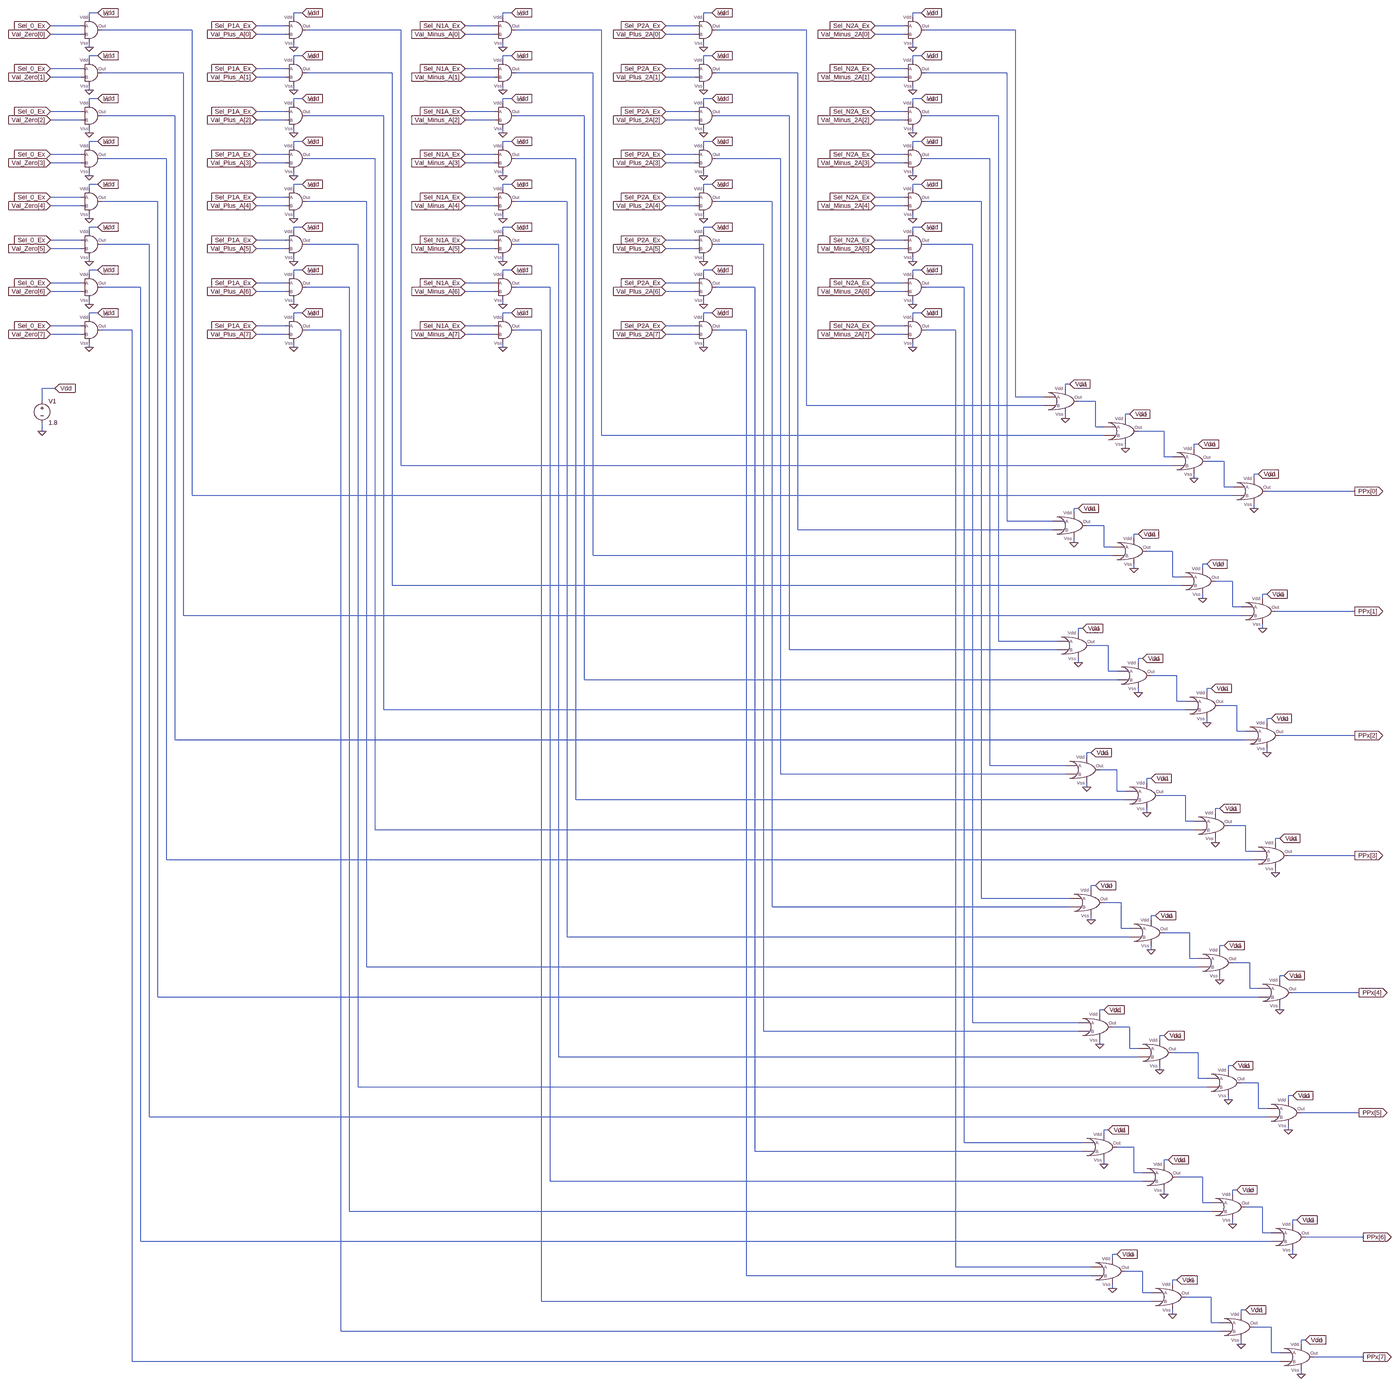
[diagram p0: schematic MUX.asc, whole sheet]
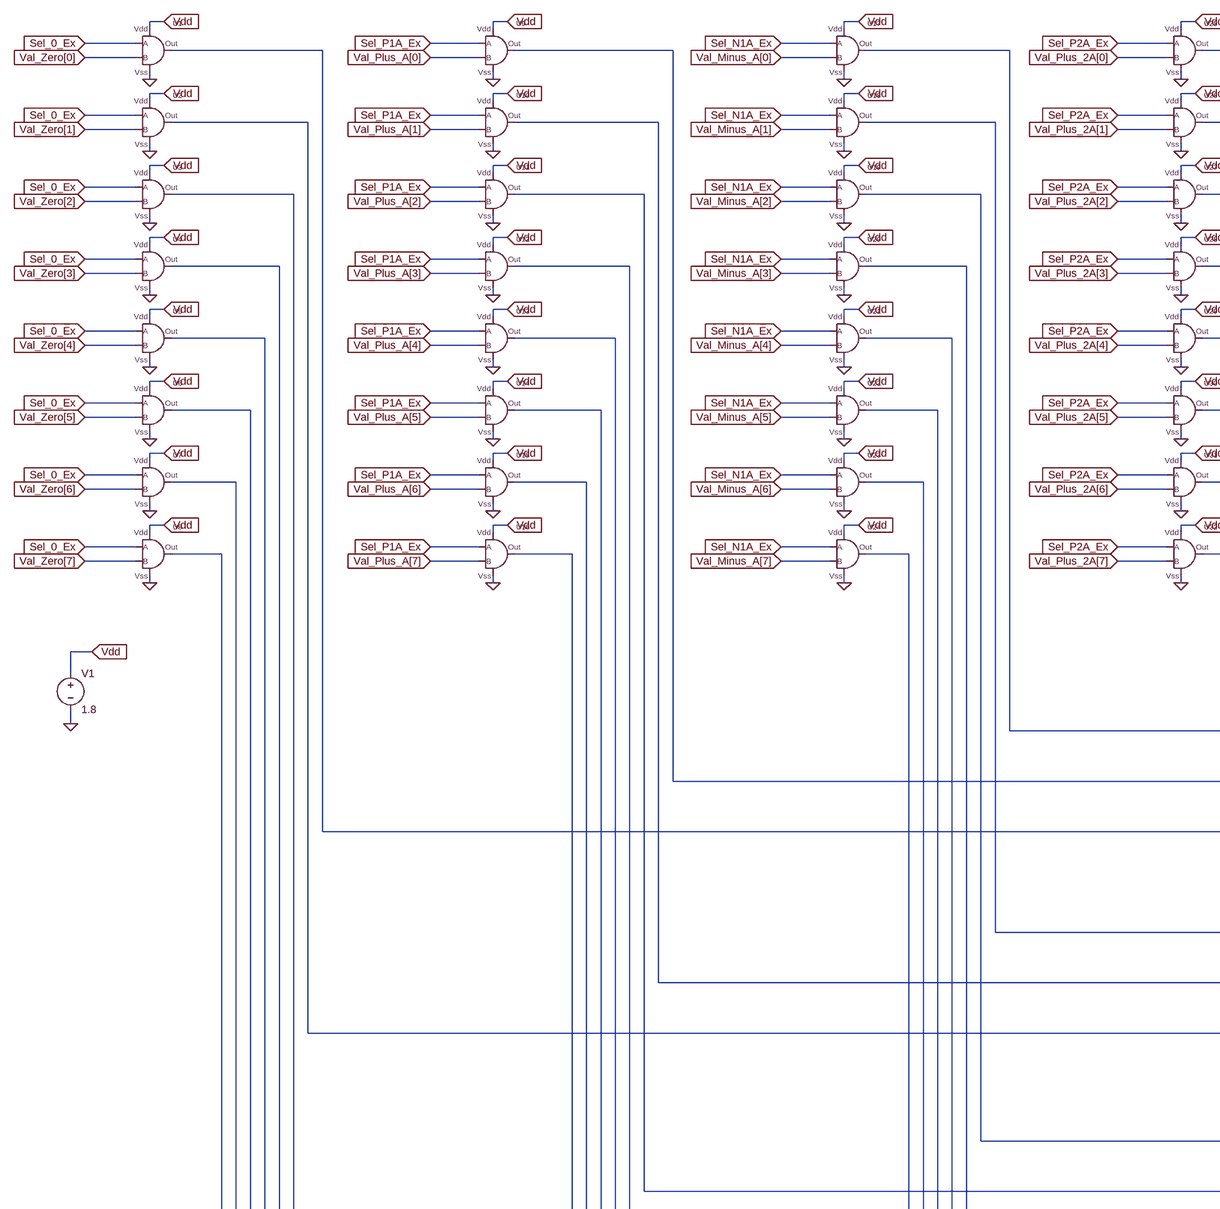
[diagram p1: schematic MUX.asc, part, row 1 of 2, column 1 of 2]
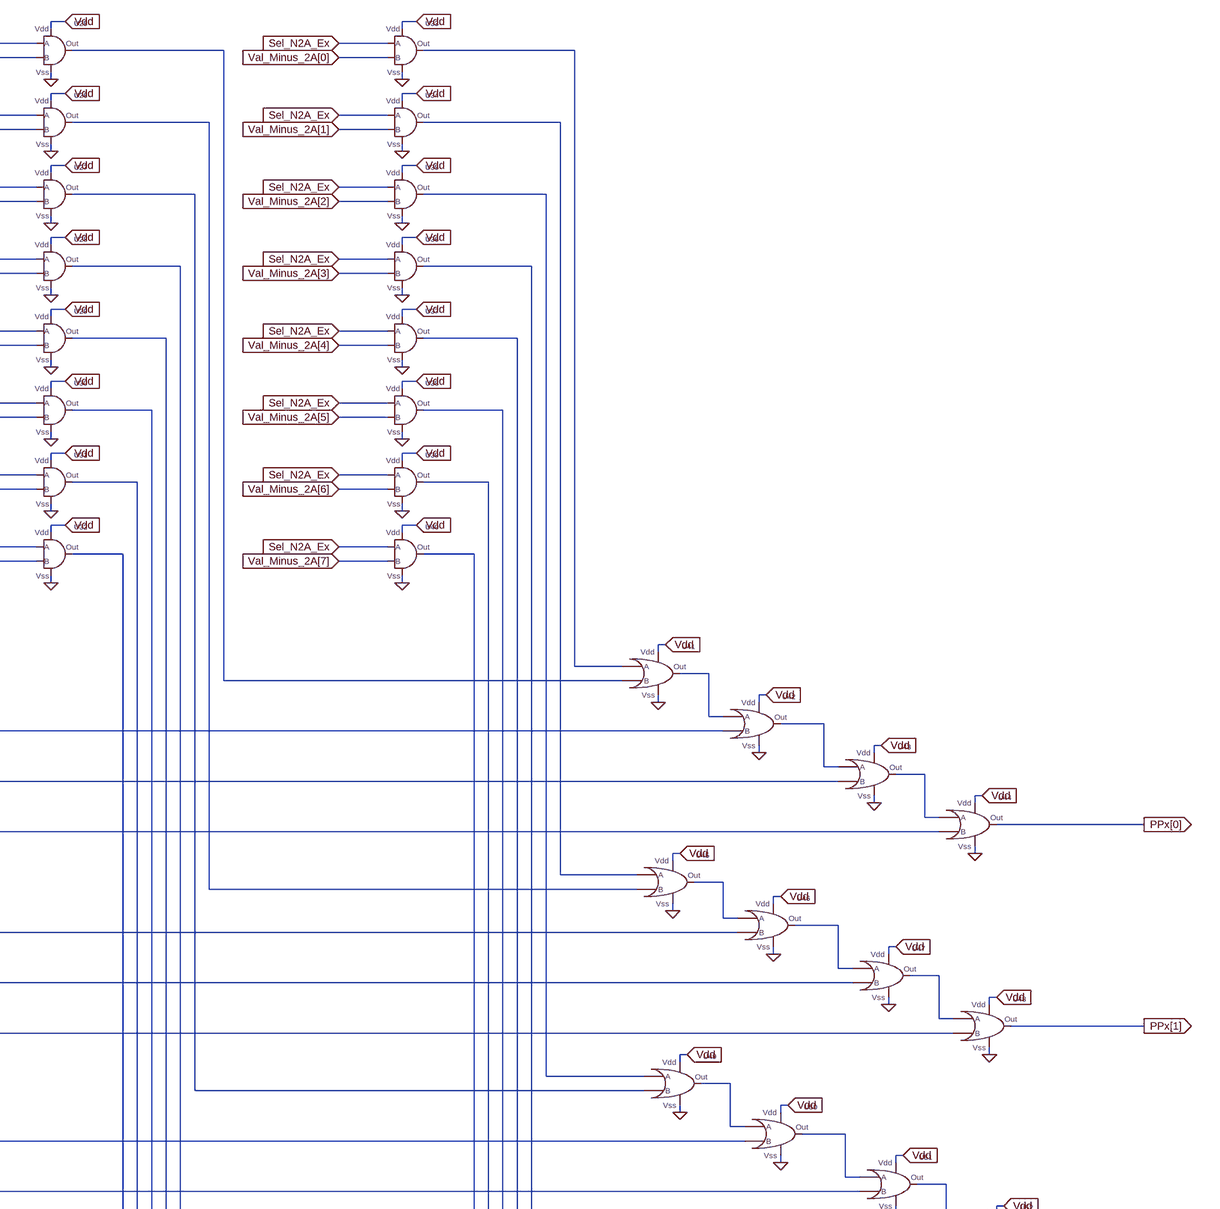
[diagram p2: schematic MUX.asc, part, row 1 of 2, column 2 of 2]
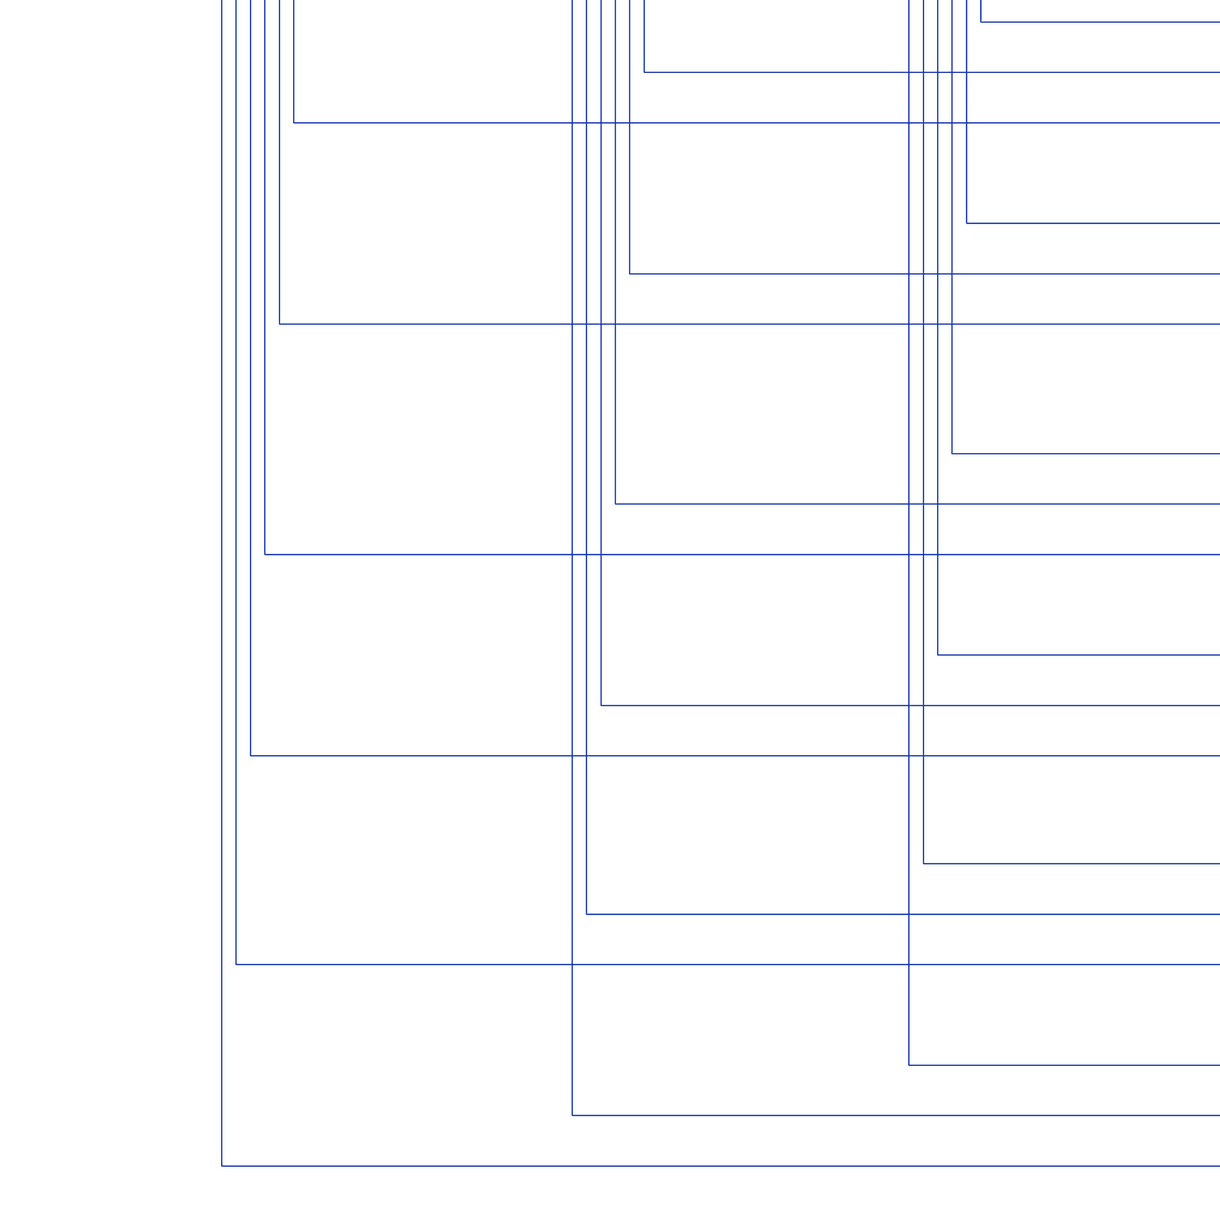
[diagram p3: schematic MUX.asc, part, row 2 of 2, column 1 of 2]
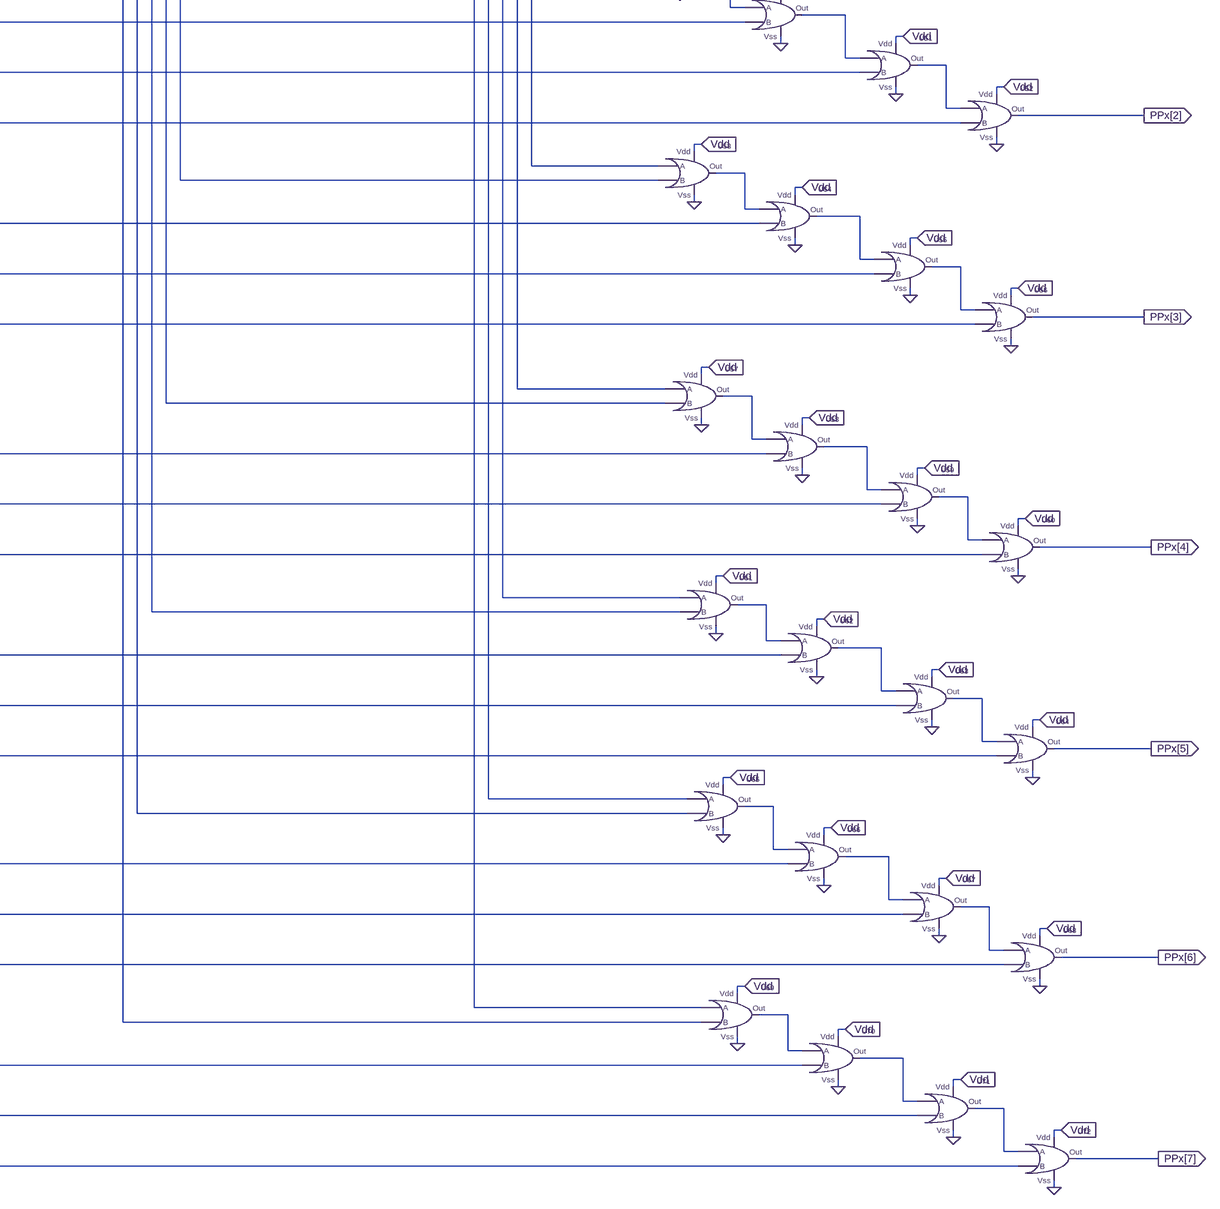
[diagram p4: schematic MUX.asc, part, row 2 of 2, column 2 of 2]
MUX.asc, the LTspice schematic file:
Version 4
SHEET 1 5656 4884
WIRE 176 -256 144 -256
WIRE 944 -256 912 -256
WIRE 1728 -256 1696 -256
WIRE 2480 -256 2448 -256
WIRE 3264 -256 3232 -256
WIRE 144 -240 144 -256
WIRE 912 -240 912 -256
WIRE 1696 -240 1696 -256
WIRE 2448 -240 2448 -256
WIRE 3232 -240 3232 -256
WIRE 112 -208 0 -208
WIRE 880 -208 768 -208
WIRE 1664 -208 1552 -208
WIRE 2416 -208 2304 -208
WIRE 3200 -208 3088 -208
WIRE 528 -192 192 -192
WIRE 1312 -192 960 -192
WIRE 2064 -192 1744 -192
WIRE 2832 -192 2496 -192
WIRE 3616 -192 3280 -192
WIRE 112 -176 0 -176
WIRE 880 -176 768 -176
WIRE 1664 -176 1552 -176
WIRE 2416 -176 2304 -176
WIRE 3200 -176 3088 -176
WIRE 144 -128 144 -144
WIRE 912 -128 912 -144
WIRE 1696 -128 1696 -144
WIRE 2448 -128 2448 -144
WIRE 3232 -128 3232 -144
WIRE 176 -96 144 -96
WIRE 944 -96 912 -96
WIRE 1728 -96 1696 -96
WIRE 2480 -96 2448 -96
WIRE 3264 -96 3232 -96
WIRE 144 -80 144 -96
WIRE 912 -80 912 -96
WIRE 1696 -80 1696 -96
WIRE 2448 -80 2448 -96
WIRE 3232 -80 3232 -96
WIRE 112 -48 0 -48
WIRE 880 -48 768 -48
WIRE 1664 -48 1552 -48
WIRE 2416 -48 2304 -48
WIRE 3200 -48 3088 -48
WIRE 496 -32 192 -32
WIRE 1280 -32 960 -32
WIRE 2032 -32 1744 -32
WIRE 2800 -32 2496 -32
WIRE 3584 -32 3280 -32
WIRE 112 -16 0 -16
WIRE 880 -16 768 -16
WIRE 1664 -16 1552 -16
WIRE 2416 -16 2304 -16
WIRE 3200 -16 3088 -16
WIRE 144 32 144 16
WIRE 912 32 912 16
WIRE 1696 32 1696 16
WIRE 2448 32 2448 16
WIRE 3232 32 3232 16
WIRE 176 64 144 64
WIRE 944 64 912 64
WIRE 1728 64 1696 64
WIRE 2480 64 2448 64
WIRE 3264 64 3232 64
WIRE 144 80 144 64
WIRE 912 80 912 64
WIRE 1696 80 1696 64
WIRE 2448 80 2448 64
WIRE 3232 80 3232 64
WIRE 112 112 0 112
WIRE 880 112 768 112
WIRE 1664 112 1552 112
WIRE 2416 112 2304 112
WIRE 3200 112 3088 112
WIRE 464 128 192 128
WIRE 1248 128 960 128
WIRE 2000 128 1744 128
WIRE 2768 128 2496 128
WIRE 3552 128 3280 128
WIRE 112 144 0 144
WIRE 880 144 768 144
WIRE 1664 144 1552 144
WIRE 2416 144 2304 144
WIRE 3200 144 3088 144
WIRE 144 192 144 176
WIRE 912 192 912 176
WIRE 1696 192 1696 176
WIRE 2448 192 2448 176
WIRE 3232 192 3232 176
WIRE 176 224 144 224
WIRE 944 224 912 224
WIRE 1728 224 1696 224
WIRE 2480 224 2448 224
WIRE 3264 224 3232 224
WIRE 144 240 144 224
WIRE 912 240 912 224
WIRE 1696 240 1696 224
WIRE 2448 240 2448 224
WIRE 3232 240 3232 224
WIRE 112 272 0 272
WIRE 880 272 768 272
WIRE 1664 272 1552 272
WIRE 2416 272 2304 272
WIRE 3200 272 3088 272
WIRE 432 288 192 288
WIRE 1216 288 960 288
WIRE 1968 288 1744 288
WIRE 2736 288 2496 288
WIRE 3520 288 3280 288
WIRE 112 304 0 304
WIRE 880 304 768 304
WIRE 1664 304 1552 304
WIRE 2416 304 2304 304
WIRE 3200 304 3088 304
WIRE 144 352 144 336
WIRE 912 352 912 336
WIRE 1696 352 1696 336
WIRE 2448 352 2448 336
WIRE 3232 352 3232 336
WIRE 176 384 144 384
WIRE 944 384 912 384
WIRE 1728 384 1696 384
WIRE 2480 384 2448 384
WIRE 3264 384 3232 384
WIRE 144 400 144 384
WIRE 912 400 912 384
WIRE 1696 400 1696 384
WIRE 2448 400 2448 384
WIRE 3232 400 3232 384
WIRE 112 432 0 432
WIRE 880 432 768 432
WIRE 1664 432 1552 432
WIRE 2416 432 2304 432
WIRE 3200 432 3088 432
WIRE 400 448 192 448
WIRE 1184 448 960 448
WIRE 1936 448 1744 448
WIRE 2704 448 2496 448
WIRE 3488 448 3280 448
WIRE 112 464 0 464
WIRE 880 464 768 464
WIRE 1664 464 1552 464
WIRE 2416 464 2304 464
WIRE 3200 464 3088 464
WIRE 144 512 144 496
WIRE 912 512 912 496
WIRE 1696 512 1696 496
WIRE 2448 512 2448 496
WIRE 3232 512 3232 496
WIRE 176 544 144 544
WIRE 944 544 912 544
WIRE 1728 544 1696 544
WIRE 2480 544 2448 544
WIRE 3264 544 3232 544
WIRE 144 560 144 544
WIRE 912 560 912 544
WIRE 1696 560 1696 544
WIRE 2448 560 2448 544
WIRE 3232 560 3232 544
WIRE 112 592 0 592
WIRE 880 592 768 592
WIRE 1664 592 1552 592
WIRE 2416 592 2304 592
WIRE 3200 592 3088 592
WIRE 368 608 192 608
WIRE 1152 608 960 608
WIRE 1904 608 1744 608
WIRE 2672 608 2496 608
WIRE 3456 608 3280 608
WIRE 112 624 0 624
WIRE 880 624 768 624
WIRE 1664 624 1552 624
WIRE 2416 624 2304 624
WIRE 3200 624 3088 624
WIRE 144 672 144 656
WIRE 912 672 912 656
WIRE 1696 672 1696 656
WIRE 2448 672 2448 656
WIRE 3232 672 3232 656
WIRE 176 704 144 704
WIRE 944 704 912 704
WIRE 1728 704 1696 704
WIRE 2480 704 2448 704
WIRE 3264 704 3232 704
WIRE 144 720 144 704
WIRE 912 720 912 704
WIRE 1696 720 1696 704
WIRE 2448 720 2448 704
WIRE 3232 720 3232 704
WIRE 112 752 0 752
WIRE 880 752 768 752
WIRE 1664 752 1552 752
WIRE 2416 752 2304 752
WIRE 3200 752 3088 752
WIRE 336 768 192 768
WIRE 1120 768 960 768
WIRE 1872 768 1744 768
WIRE 2640 768 2496 768
WIRE 3424 768 3280 768
WIRE 112 784 0 784
WIRE 880 784 768 784
WIRE 1664 784 1552 784
WIRE 2416 784 2304 784
WIRE 3200 784 3088 784
WIRE 144 832 144 816
WIRE 912 832 912 816
WIRE 1696 832 1696 816
WIRE 2448 832 2448 816
WIRE 3232 832 3232 816
WIRE 176 864 144 864
WIRE 944 864 912 864
WIRE 1728 864 1696 864
WIRE 2480 864 2448 864
WIRE 3264 864 3232 864
WIRE 144 880 144 864
WIRE 912 880 912 864
WIRE 1696 880 1696 864
WIRE 2448 880 2448 864
WIRE 3232 880 3232 864
WIRE 112 912 0 912
WIRE 880 912 768 912
WIRE 1664 912 1552 912
WIRE 2416 912 2304 912
WIRE 3200 912 3088 912
WIRE 304 928 192 928
WIRE 1088 928 960 928
WIRE 1840 928 1744 928
WIRE 2608 928 2496 928
WIRE 3392 928 3280 928
WIRE 112 944 0 944
WIRE 880 944 768 944
WIRE 1664 944 1552 944
WIRE 2416 944 2304 944
WIRE 3200 944 3088 944
WIRE 144 992 144 976
WIRE 912 992 912 976
WIRE 1696 992 1696 976
WIRE 2448 992 2448 976
WIRE 3232 992 3232 976
WIRE 3856 1168 3840 1168
WIRE 16 1184 -32 1184
WIRE 3840 1184 3840 1168
WIRE 3616 1216 3616 -192
WIRE 3760 1216 3616 1216
WIRE -32 1232 -32 1184
WIRE 3952 1232 3888 1232
WIRE 2832 1248 2832 -192
WIRE 3760 1248 2832 1248
WIRE 4080 1280 4064 1280
WIRE 3840 1296 3840 1280
WIRE 4064 1296 4064 1280
WIRE 3952 1328 3952 1232
WIRE 3984 1328 3952 1328
WIRE -32 1344 -32 1312
WIRE 4208 1344 4112 1344
WIRE 2064 1360 2064 -192
WIRE 3984 1360 2064 1360
WIRE 4336 1392 4320 1392
WIRE 4064 1408 4064 1392
WIRE 4320 1408 4320 1392
WIRE 4208 1440 4208 1344
WIRE 4240 1440 4208 1440
WIRE 4432 1456 4368 1456
WIRE 1312 1472 1312 -192
WIRE 4240 1472 1312 1472
WIRE 4560 1504 4544 1504
WIRE 4320 1520 4320 1504
WIRE 4544 1520 4544 1504
WIRE 4432 1552 4432 1456
WIRE 4464 1552 4432 1552
WIRE 4928 1568 4592 1568
WIRE 528 1584 528 -192
WIRE 4464 1584 528 1584
WIRE 3888 1632 3872 1632
WIRE 4544 1632 4544 1616
WIRE 3872 1648 3872 1632
WIRE 3584 1680 3584 -32
WIRE 3792 1680 3584 1680
WIRE 3984 1696 3920 1696
WIRE 2800 1712 2800 -32
WIRE 3792 1712 2800 1712
WIRE 4112 1728 4096 1728
WIRE 4096 1744 4096 1728
WIRE 3872 1760 3872 1744
WIRE 3984 1776 3984 1696
WIRE 4016 1776 3984 1776
WIRE 4240 1792 4144 1792
WIRE 2032 1808 2032 -32
WIRE 4016 1808 2032 1808
WIRE 4368 1840 4352 1840
WIRE 4096 1856 4096 1840
WIRE 4352 1856 4352 1840
WIRE 4240 1888 4240 1792
WIRE 4272 1888 4240 1888
WIRE 4464 1904 4400 1904
WIRE 1280 1920 1280 -32
WIRE 4272 1920 1280 1920
WIRE 4592 1952 4576 1952
WIRE 4352 1968 4352 1952
WIRE 4576 1968 4576 1952
WIRE 4464 2000 4464 1904
WIRE 4496 2000 4464 2000
WIRE 4928 2016 4624 2016
WIRE 496 2032 496 -32
WIRE 4496 2032 496 2032
WIRE 3904 2080 3888 2080
WIRE 4576 2080 4576 2064
WIRE 3888 2096 3888 2080
WIRE 3552 2128 3552 128
WIRE 3808 2128 3552 2128
WIRE 4000 2144 3936 2144
WIRE 2768 2160 2768 128
WIRE 3808 2160 2768 2160
WIRE 4128 2192 4112 2192
WIRE 3888 2208 3888 2192
WIRE 4112 2208 4112 2192
WIRE 4000 2240 4000 2144
WIRE 4032 2240 4000 2240
WIRE 4256 2256 4160 2256
WIRE 2000 2272 2000 128
WIRE 4032 2272 2000 2272
WIRE 4384 2304 4368 2304
WIRE 4112 2320 4112 2304
WIRE 4368 2320 4368 2304
WIRE 4256 2352 4256 2256
WIRE 4288 2352 4256 2352
WIRE 4480 2368 4416 2368
WIRE 1248 2384 1248 128
WIRE 4288 2384 1248 2384
WIRE 4608 2416 4592 2416
WIRE 4368 2432 4368 2416
WIRE 4592 2432 4592 2416
WIRE 4480 2464 4480 2368
WIRE 4512 2464 4480 2464
WIRE 4928 2480 4640 2480
WIRE 464 2496 464 128
WIRE 4512 2496 464 2496
WIRE 3936 2544 3920 2544
WIRE 4592 2544 4592 2528
WIRE 3920 2560 3920 2544
WIRE 3520 2592 3520 288
WIRE 3840 2592 3520 2592
WIRE 4032 2608 3968 2608
WIRE 2736 2624 2736 288
WIRE 3840 2624 2736 2624
WIRE 4160 2640 4144 2640
WIRE 4144 2656 4144 2640
WIRE 3920 2672 3920 2656
WIRE 4032 2688 4032 2608
WIRE 4064 2688 4032 2688
WIRE 4288 2704 4192 2704
WIRE 1968 2720 1968 288
WIRE 4064 2720 1968 2720
WIRE 4416 2752 4400 2752
WIRE 4144 2768 4144 2752
WIRE 4400 2768 4400 2752
WIRE 4288 2800 4288 2704
WIRE 4320 2800 4288 2800
WIRE 4512 2816 4448 2816
WIRE 1216 2832 1216 288
WIRE 4320 2832 1216 2832
WIRE 4640 2864 4624 2864
WIRE 4400 2880 4400 2864
WIRE 4624 2880 4624 2864
WIRE 4512 2912 4512 2816
WIRE 4544 2912 4512 2912
WIRE 4928 2928 4672 2928
WIRE 432 2944 432 288
WIRE 4544 2944 432 2944
WIRE 4624 2992 4624 2976
WIRE 3952 3040 3936 3040
WIRE 3936 3056 3936 3040
WIRE 3488 3088 3488 448
WIRE 3856 3088 3488 3088
WIRE 4048 3104 3984 3104
WIRE 2704 3120 2704 448
WIRE 3856 3120 2704 3120
WIRE 4176 3152 4160 3152
WIRE 3936 3168 3936 3152
WIRE 4160 3168 4160 3152
WIRE 4048 3200 4048 3104
WIRE 4080 3200 4048 3200
WIRE 4304 3216 4208 3216
WIRE 1936 3232 1936 448
WIRE 4080 3232 1936 3232
WIRE 4432 3264 4416 3264
WIRE 4160 3280 4160 3264
WIRE 4416 3280 4416 3264
WIRE 4304 3312 4304 3216
WIRE 4336 3312 4304 3312
WIRE 4528 3328 4464 3328
WIRE 1184 3344 1184 448
WIRE 4336 3344 1184 3344
WIRE 4656 3376 4640 3376
WIRE 4416 3392 4416 3376
WIRE 4640 3392 4640 3376
WIRE 4528 3424 4528 3328
WIRE 4560 3424 4528 3424
WIRE 4944 3440 4688 3440
WIRE 400 3456 400 448
WIRE 4560 3456 400 3456
WIRE 3984 3504 3968 3504
WIRE 4640 3504 4640 3488
WIRE 3968 3520 3968 3504
WIRE 3456 3552 3456 608
WIRE 3888 3552 3456 3552
WIRE 4080 3568 4016 3568
WIRE 2672 3584 2672 608
WIRE 3888 3584 2672 3584
WIRE 4208 3600 4192 3600
WIRE 4192 3616 4192 3600
WIRE 3968 3632 3968 3616
WIRE 4080 3648 4080 3568
WIRE 4112 3648 4080 3648
WIRE 4336 3664 4240 3664
WIRE 1904 3680 1904 608
WIRE 4112 3680 1904 3680
WIRE 4464 3712 4448 3712
WIRE 4192 3728 4192 3712
WIRE 4448 3728 4448 3712
WIRE 4336 3760 4336 3664
WIRE 4368 3760 4336 3760
WIRE 4560 3776 4496 3776
WIRE 1152 3792 1152 608
WIRE 4368 3792 1152 3792
WIRE 4688 3824 4672 3824
WIRE 4448 3840 4448 3824
WIRE 4672 3840 4672 3824
WIRE 4560 3872 4560 3776
WIRE 4592 3872 4560 3872
WIRE 4944 3888 4720 3888
WIRE 368 3904 368 608
WIRE 4592 3904 368 3904
WIRE 4000 3952 3984 3952
WIRE 4672 3952 4672 3936
WIRE 3984 3968 3984 3952
WIRE 3424 4000 3424 768
WIRE 3904 4000 3424 4000
WIRE 4096 4016 4032 4016
WIRE 2640 4032 2640 768
WIRE 3904 4032 2640 4032
WIRE 4224 4064 4208 4064
WIRE 3984 4080 3984 4064
WIRE 4208 4080 4208 4064
WIRE 4096 4112 4096 4016
WIRE 4128 4112 4096 4112
WIRE 4352 4128 4256 4128
WIRE 1872 4144 1872 768
WIRE 4128 4144 1872 4144
WIRE 4480 4176 4464 4176
WIRE 4208 4192 4208 4176
WIRE 4464 4192 4464 4176
WIRE 4352 4224 4352 4128
WIRE 4384 4224 4352 4224
WIRE 4576 4240 4512 4240
WIRE 1120 4256 1120 768
WIRE 4384 4256 1120 4256
WIRE 4704 4288 4688 4288
WIRE 4464 4304 4464 4288
WIRE 4688 4304 4688 4288
WIRE 4576 4336 4576 4240
WIRE 4608 4336 4576 4336
WIRE 4960 4352 4736 4352
WIRE 336 4368 336 768
WIRE 4608 4368 336 4368
WIRE 4032 4416 4016 4416
WIRE 4688 4416 4688 4400
WIRE 4016 4432 4016 4416
WIRE 3392 4464 3392 928
WIRE 3936 4464 3392 4464
WIRE 4128 4480 4064 4480
WIRE 2608 4496 2608 928
WIRE 3936 4496 2608 4496
WIRE 4256 4512 4240 4512
WIRE 4240 4528 4240 4512
WIRE 4016 4544 4016 4528
WIRE 4128 4560 4128 4480
WIRE 4160 4560 4128 4560
WIRE 4384 4576 4288 4576
WIRE 1840 4592 1840 928
WIRE 4160 4592 1840 4592
WIRE 4512 4624 4496 4624
WIRE 4240 4640 4240 4624
WIRE 4496 4640 4496 4624
WIRE 4384 4672 4384 4576
WIRE 4416 4672 4384 4672
WIRE 4608 4688 4544 4688
WIRE 1088 4704 1088 928
WIRE 4416 4704 1088 4704
WIRE 4736 4736 4720 4736
WIRE 4496 4752 4496 4736
WIRE 4720 4752 4720 4736
WIRE 4608 4784 4608 4688
WIRE 4640 4784 4608 4784
WIRE 4960 4800 4768 4800
WIRE 304 4816 304 928
WIRE 4640 4816 304 4816
WIRE 4720 4864 4720 4848
FLAG 0 -208 Sel_0_Ex
IOPIN 0 -208 In
FLAG 0 -176 Val_Zero[0]
IOPIN 0 -176 In
FLAG 0 -48 Sel_0_Ex
IOPIN 0 -48 In
FLAG 0 -16 Val_Zero[1]
IOPIN 0 -16 In
FLAG 144 -128 0
FLAG 176 -256 Vdd
IOPIN 176 -256 In
FLAG 144 32 0
FLAG 176 -96 Vdd
IOPIN 176 -96 In
FLAG 0 112 Sel_0_Ex
IOPIN 0 112 In
FLAG 0 144 Val_Zero[2]
IOPIN 0 144 In
FLAG 0 272 Sel_0_Ex
IOPIN 0 272 In
FLAG 0 304 Val_Zero[3]
IOPIN 0 304 In
FLAG 144 192 0
FLAG 176 64 Vdd
IOPIN 176 64 In
FLAG 144 352 0
FLAG 176 224 Vdd
IOPIN 176 224 In
FLAG 0 432 Sel_0_Ex
IOPIN 0 432 In
FLAG 0 464 Val_Zero[4]
IOPIN 0 464 In
FLAG 0 592 Sel_0_Ex
IOPIN 0 592 In
FLAG 0 624 Val_Zero[5]
IOPIN 0 624 In
FLAG 144 512 0
FLAG 176 384 Vdd
IOPIN 176 384 In
FLAG 144 672 0
FLAG 176 544 Vdd
IOPIN 176 544 In
FLAG 0 752 Sel_0_Ex
IOPIN 0 752 In
FLAG 0 784 Val_Zero[6]
IOPIN 0 784 In
FLAG 0 912 Sel_0_Ex
IOPIN 0 912 In
FLAG 0 944 Val_Zero[7]
IOPIN 0 944 In
FLAG 144 832 0
FLAG 176 704 Vdd
IOPIN 176 704 In
FLAG 144 992 0
FLAG 176 864 Vdd
IOPIN 176 864 In
FLAG 768 -208 Sel_P1A_Ex
IOPIN 768 -208 In
FLAG 768 -176 Val_Plus_A[0]
IOPIN 768 -176 In
FLAG 768 -16 Val_Plus_A[1]
IOPIN 768 -16 In
FLAG 912 -128 0
FLAG 944 -256 Vdd
IOPIN 944 -256 In
FLAG 912 32 0
FLAG 944 -96 Vdd
IOPIN 944 -96 In
FLAG 768 144 Val_Plus_A[2]
IOPIN 768 144 In
FLAG 768 304 Val_Plus_A[3]
IOPIN 768 304 In
FLAG 912 192 0
FLAG 944 64 Vdd
IOPIN 944 64 In
FLAG 912 352 0
FLAG 944 224 Vdd
IOPIN 944 224 In
FLAG 768 464 Val_Plus_A[4]
IOPIN 768 464 In
FLAG 768 624 Val_Plus_A[5]
IOPIN 768 624 In
FLAG 912 512 0
FLAG 944 384 Vdd
IOPIN 944 384 In
FLAG 912 672 0
FLAG 944 544 Vdd
IOPIN 944 544 In
FLAG 768 784 Val_Plus_A[6]
IOPIN 768 784 In
FLAG 768 944 Val_Plus_A[7]
IOPIN 768 944 In
FLAG 912 832 0
FLAG 944 704 Vdd
IOPIN 944 704 In
FLAG 912 992 0
FLAG 944 864 Vdd
IOPIN 944 864 In
FLAG 1552 -208 Sel_N1A_Ex
IOPIN 1552 -208 In
FLAG 1552 -176 Val_Minus_A[0]
IOPIN 1552 -176 In
FLAG 1552 -16 Val_Minus_A[1]
IOPIN 1552 -16 In
FLAG 1696 -128 0
FLAG 1728 -256 Vdd
IOPIN 1728 -256 In
FLAG 1696 32 0
FLAG 1728 -96 Vdd
IOPIN 1728 -96 In
FLAG 1552 144 Val_Minus_A[2]
IOPIN 1552 144 In
FLAG 1552 304 Val_Minus_A[3]
IOPIN 1552 304 In
FLAG 1696 192 0
FLAG 1728 64 Vdd
IOPIN 1728 64 In
FLAG 1696 352 0
FLAG 1728 224 Vdd
IOPIN 1728 224 In
FLAG 1552 464 Val_Minus_A[4]
IOPIN 1552 464 In
FLAG 1552 624 Val_Minus_A[5]
IOPIN 1552 624 In
FLAG 1696 512 0
FLAG 1728 384 Vdd
IOPIN 1728 384 In
FLAG 1696 672 0
FLAG 1728 544 Vdd
IOPIN 1728 544 In
FLAG 1552 784 Val_Minus_A[6]
IOPIN 1552 784 In
FLAG 1552 944 Val_Minus_A[7]
IOPIN 1552 944 In
FLAG 1696 832 0
FLAG 1728 704 Vdd
IOPIN 1728 704 In
FLAG 1696 992 0
FLAG 1728 864 Vdd
IOPIN 1728 864 In
FLAG 2304 -208 Sel_P2A_Ex
IOPIN 2304 -208 In
FLAG 2304 -176 Val_Plus_2A[0]
IOPIN 2304 -176 In
FLAG 2304 -16 Val_Plus_2A[1]
IOPIN 2304 -16 In
FLAG 2448 -128 0
FLAG 2480 -256 Vdd
IOPIN 2480 -256 In
FLAG 2448 32 0
FLAG 2480 -96 Vdd
IOPIN 2480 -96 In
FLAG 2304 144 Val_Plus_2A[2]
IOPIN 2304 144 In
FLAG 2304 304 Val_Plus_2A[3]
IOPIN 2304 304 In
FLAG 2448 192 0
FLAG 2480 64 Vdd
IOPIN 2480 64 In
FLAG 2448 352 0
FLAG 2480 224 Vdd
IOPIN 2480 224 In
FLAG 2304 464 Val_Plus_2A[4]
IOPIN 2304 464 In
FLAG 2304 624 Val_Plus_2A[5]
IOPIN 2304 624 In
FLAG 2448 512 0
FLAG 2480 384 Vdd
IOPIN 2480 384 In
FLAG 2448 672 0
FLAG 2480 544 Vdd
IOPIN 2480 544 In
FLAG 2304 784 Val_Plus_2A[6]
IOPIN 2304 784 In
FLAG 2304 944 Val_Plus_2A[7]
IOPIN 2304 944 In
FLAG 2448 832 0
FLAG 2480 704 Vdd
IOPIN 2480 704 In
FLAG 2448 992 0
FLAG 2480 864 Vdd
IOPIN 2480 864 In
FLAG 768 -48 Sel_P1A_Ex
IOPIN 768 -48 In
FLAG 768 112 Sel_P1A_Ex
IOPIN 768 112 In
FLAG 768 272 Sel_P1A_Ex
IOPIN 768 272 In
FLAG 768 432 Sel_P1A_Ex
IOPIN 768 432 In
FLAG 768 592 Sel_P1A_Ex
IOPIN 768 592 In
FLAG 768 752 Sel_P1A_Ex
IOPIN 768 752 In
FLAG 768 912 Sel_P1A_Ex
IOPIN 768 912 In
FLAG 1552 -48 Sel_N1A_Ex
IOPIN 1552 -48 In
FLAG 1552 112 Sel_N1A_Ex
IOPIN 1552 112 In
FLAG 1552 272 Sel_N1A_Ex
IOPIN 1552 272 In
FLAG 1552 432 Sel_N1A_Ex
IOPIN 1552 432 In
FLAG 1552 592 Sel_N1A_Ex
IOPIN 1552 592 In
FLAG 1552 752 Sel_N1A_Ex
IOPIN 1552 752 In
FLAG 1552 912 Sel_N1A_Ex
IOPIN 1552 912 In
FLAG 2304 -48 Sel_P2A_Ex
IOPIN 2304 -48 In
FLAG 2304 112 Sel_P2A_Ex
IOPIN 2304 112 In
FLAG 2304 272 Sel_P2A_Ex
IOPIN 2304 272 In
FLAG 2304 432 Sel_P2A_Ex
IOPIN 2304 432 In
FLAG 2304 592 Sel_P2A_Ex
IOPIN 2304 592 In
FLAG 2304 752 Sel_P2A_Ex
IOPIN 2304 752 In
FLAG 2304 912 Sel_P2A_Ex
IOPIN 2304 912 In
FLAG 3088 -208 Sel_N2A_Ex
IOPIN 3088 -208 In
FLAG 3088 -176 Val_Minus_2A[0]
IOPIN 3088 -176 In
FLAG 3088 -16 Val_Minus_2A[1]
IOPIN 3088 -16 In
FLAG 3232 -128 0
FLAG 3264 -256 Vdd
IOPIN 3264 -256 In
FLAG 3232 32 0
FLAG 3264 -96 Vdd
IOPIN 3264 -96 In
FLAG 3088 144 Val_Minus_2A[2]
IOPIN 3088 144 In
FLAG 3088 304 Val_Minus_2A[3]
IOPIN 3088 304 In
FLAG 3232 192 0
FLAG 3264 64 Vdd
IOPIN 3264 64 In
FLAG 3232 352 0
FLAG 3264 224 Vdd
IOPIN 3264 224 In
FLAG 3088 464 Val_Minus_2A[4]
IOPIN 3088 464 In
FLAG 3088 624 Val_Minus_2A[5]
IOPIN 3088 624 In
FLAG 3232 512 0
FLAG 3264 384 Vdd
IOPIN 3264 384 In
FLAG 3232 672 0
FLAG 3264 544 Vdd
IOPIN 3264 544 In
FLAG 3088 784 Val_Minus_2A[6]
IOPIN 3088 784 In
FLAG 3088 944 Val_Minus_2A[7]
IOPIN 3088 944 In
FLAG 3232 832 0
FLAG 3264 704 Vdd
IOPIN 3264 704 In
FLAG 3232 992 0
FLAG 3264 864 Vdd
IOPIN 3264 864 In
FLAG 3088 -48 Sel_N2A_Ex
IOPIN 3088 -48 In
FLAG 3088 112 Sel_N2A_Ex
IOPIN 3088 112 In
FLAG 3088 272 Sel_N2A_Ex
IOPIN 3088 272 In
FLAG 3088 432 Sel_N2A_Ex
IOPIN 3088 432 In
FLAG 3088 592 Sel_N2A_Ex
IOPIN 3088 592 In
FLAG 3088 752 Sel_N2A_Ex
IOPIN 3088 752 In
FLAG 3088 912 Sel_N2A_Ex
IOPIN 3088 912 In
FLAG 3840 1296 0
FLAG 3856 1168 Vdd
IOPIN 3856 1168 In
FLAG 4064 1408 0
FLAG 4080 1280 Vdd
IOPIN 4080 1280 In
FLAG 4320 1520 0
FLAG 4336 1392 Vdd
IOPIN 4336 1392 In
FLAG 4544 1632 0
FLAG 4560 1504 Vdd
IOPIN 4560 1504 In
FLAG 3872 1760 0
FLAG 3888 1632 Vdd
IOPIN 3888 1632 In
FLAG 4096 1856 0
FLAG 4112 1728 Vdd
IOPIN 4112 1728 In
FLAG 4352 1968 0
FLAG 4368 1840 Vdd
IOPIN 4368 1840 In
FLAG 4576 2080 0
FLAG 4592 1952 Vdd
IOPIN 4592 1952 In
FLAG 3888 2208 0
FLAG 3904 2080 Vdd
IOPIN 3904 2080 In
FLAG 4112 2320 0
FLAG 4128 2192 Vdd
IOPIN 4128 2192 In
FLAG 4368 2432 0
FLAG 4384 2304 Vdd
IOPIN 4384 2304 In
FLAG 4592 2544 0
FLAG 4608 2416 Vdd
IOPIN 4608 2416 In
FLAG 3920 2672 0
FLAG 3936 2544 Vdd
IOPIN 3936 2544 In
FLAG 4144 2768 0
FLAG 4160 2640 Vdd
IOPIN 4160 2640 In
FLAG 4400 2880 0
FLAG 4416 2752 Vdd
IOPIN 4416 2752 In
FLAG 4624 2992 0
FLAG 4640 2864 Vdd
IOPIN 4640 2864 In
FLAG 3936 3168 0
FLAG 3952 3040 Vdd
IOPIN 3952 3040 In
FLAG 4160 3280 0
FLAG 4176 3152 Vdd
IOPIN 4176 3152 In
FLAG 4416 3392 0
FLAG 4432 3264 Vdd
IOPIN 4432 3264 In
FLAG 4640 3504 0
FLAG 4656 3376 Vdd
IOPIN 4656 3376 In
FLAG 3968 3632 0
FLAG 3984 3504 Vdd
IOPIN 3984 3504 In
FLAG 4192 3728 0
FLAG 4208 3600 Vdd
IOPIN 4208 3600 In
FLAG 4448 3840 0
FLAG 4464 3712 Vdd
IOPIN 4464 3712 In
FLAG 4672 3952 0
FLAG 4688 3824 Vdd
IOPIN 4688 3824 In
FLAG 3984 4080 0
FLAG 4000 3952 Vdd
IOPIN 4000 3952 In
FLAG 4208 4192 0
FLAG 4224 4064 Vdd
IOPIN 4224 4064 In
FLAG 4464 4304 0
FLAG 4480 4176 Vdd
IOPIN 4480 4176 In
FLAG 4688 4416 0
FLAG 4704 4288 Vdd
IOPIN 4704 4288 In
FLAG 4016 4544 0
FLAG 4032 4416 Vdd
IOPIN 4032 4416 In
FLAG 4240 4640 0
FLAG 4256 4512 Vdd
IOPIN 4256 4512 In
FLAG 4496 4752 0
FLAG 4512 4624 Vdd
IOPIN 4512 4624 In
FLAG 4720 4864 0
FLAG 4736 4736 Vdd
IOPIN 4736 4736 In
FLAG 4928 1568 PPx[0]
IOPIN 4928 1568 Out
FLAG 4928 2016 PPx[1]
IOPIN 4928 2016 Out
FLAG 4928 2480 PPx[2]
IOPIN 4928 2480 Out
FLAG 4928 2928 PPx[3]
IOPIN 4928 2928 Out
FLAG 4944 3440 PPx[4]
IOPIN 4944 3440 Out
FLAG 4944 3888 PPx[5]
IOPIN 4944 3888 Out
FLAG 4960 4352 PPx[6]
IOPIN 4960 4352 Out
FLAG 4960 4800 PPx[7]
IOPIN 4960 4800 Out
FLAG -32 1344 0
FLAG 16 1184 Vdd
IOPIN 16 1184 In
SYMBOL AND1 128 -192 R0
SYMATTR InstName U1
SYMBOL AND1 128 -32 R0
SYMATTR InstName U2
SYMBOL AND1 128 128 R0
SYMATTR InstName U3
SYMBOL AND1 128 288 R0
SYMATTR InstName U4
SYMBOL AND1 128 448 R0
SYMATTR InstName U5
SYMBOL AND1 128 608 R0
SYMATTR InstName U6
SYMBOL AND1 128 768 R0
SYMATTR InstName U7
SYMBOL AND1 128 928 R0
SYMATTR InstName U8
SYMBOL AND1 896 -192 R0
SYMATTR InstName U9
SYMBOL AND1 896 -32 R0
SYMATTR InstName U10
SYMBOL AND1 896 128 R0
SYMATTR InstName U11
SYMBOL AND1 896 288 R0
SYMATTR InstName U12
SYMBOL AND1 896 448 R0
SYMATTR InstName U13
SYMBOL AND1 896 608 R0
SYMATTR InstName U14
SYMBOL AND1 896 768 R0
SYMATTR InstName U15
SYMBOL AND1 896 928 R0
SYMATTR InstName U16
SYMBOL AND1 1680 -192 R0
SYMATTR InstName U17
SYMBOL AND1 1680 -32 R0
SYMATTR InstName U18
SYMBOL AND1 1680 128 R0
SYMATTR InstName U19
SYMBOL AND1 1680 288 R0
SYMATTR InstName U20
SYMBOL AND1 1680 448 R0
SYMATTR InstName U21
SYMBOL AND1 1680 608 R0
SYMATTR InstName U22
SYMBOL AND1 1680 768 R0
SYMATTR InstName U23
SYMBOL AND1 1680 928 R0
SYMATTR InstName U24
SYMBOL AND1 2432 -192 R0
SYMATTR InstName U25
SYMBOL AND1 2432 -32 R0
SYMATTR InstName U26
SYMBOL AND1 2432 128 R0
SYMATTR InstName U27
SYMBOL AND1 2432 288 R0
SYMATTR InstName U28
SYMBOL AND1 2432 448 R0
SYMATTR InstName U29
SYMBOL AND1 2432 608 R0
SYMATTR InstName U30
SYMBOL AND1 2432 768 R0
SYMATTR InstName U31
SYMBOL AND1 2432 928 R0
SYMATTR InstName U32
SYMBOL AND1 3216 -192 R0
SYMATTR InstName U33
SYMBOL AND1 3216 -32 R0
SYMATTR InstName U34
SYMBOL AND1 3216 128 R0
SYMATTR InstName U35
SYMBOL AND1 3216 288 R0
SYMATTR InstName U36
SYMBOL AND1 3216 448 R0
SYMATTR InstName U37
SYMBOL AND1 3216 608 R0
SYMATTR InstName U38
SYMBOL AND1 3216 768 R0
SYMATTR InstName U39
SYMBOL AND1 3216 928 R0
SYMATTR InstName U40
SYMBOL OR1 3776 1232 R0
SYMATTR InstName U41
SYMBOL OR1 4000 1344 R0
SYMATTR InstName U42
SYMBOL OR1 4256 1456 R0
SYMATTR InstName U43
SYMBOL OR1 4480 1568 R0
SYMATTR InstName U44
SYMBOL OR1 3808 1696 R0
SYMATTR InstName U45
SYMBOL OR1 4032 1792 R0
SYMATTR InstName U46
SYMBOL OR1 4288 1904 R0
SYMATTR InstName U47
SYMBOL OR1 4512 2016 R0
SYMATTR InstName U48
SYMBOL OR1 3824 2144 R0
SYMATTR InstName U49
SYMBOL OR1 4048 2256 R0
SYMATTR InstName U50
SYMBOL OR1 4304 2368 R0
SYMATTR InstName U51
SYMBOL OR1 4528 2480 R0
SYMATTR InstName U52
SYMBOL OR1 3856 2608 R0
SYMATTR InstName U53
SYMBOL OR1 4080 2704 R0
SYMATTR InstName U54
SYMBOL OR1 4336 2816 R0
SYMATTR InstName U55
SYMBOL OR1 4560 2928 R0
SYMATTR InstName U56
SYMBOL OR1 3872 3104 R0
SYMATTR InstName U57
SYMBOL OR1 4096 3216 R0
SYMATTR InstName U58
SYMBOL OR1 4352 3328 R0
SYMATTR InstName U59
SYMBOL OR1 4576 3440 R0
SYMATTR InstName U60
SYMBOL OR1 3904 3568 R0
SYMATTR InstName U61
SYMBOL OR1 4128 3664 R0
SYMATTR InstName U62
SYMBOL OR1 4384 3776 R0
SYMATTR InstName U63
SYMBOL OR1 4608 3888 R0
SYMATTR InstName U64
SYMBOL OR1 3920 4016 R0
SYMATTR InstName U65
SYMBOL OR1 4144 4128 R0
SYMATTR InstName U66
SYMBOL OR1 4400 4240 R0
SYMATTR InstName U67
SYMBOL OR1 4624 4352 R0
SYMATTR InstName U68
SYMBOL OR1 3952 4480 R0
SYMATTR InstName U69
SYMBOL OR1 4176 4576 R0
SYMATTR InstName U70
SYMBOL OR1 4432 4688 R0
SYMATTR InstName U71
SYMBOL OR1 4656 4800 R0
SYMATTR InstName U72
SYMBOL voltage -32 1216 R0
WINDOW 123 0 0 Left 0
WINDOW 39 0 0 Left 0
SYMATTR InstName V1
SYMATTR Value 1.8

The netlist it stands for:
* MUX.asc
XU1 Vdd 0 Sel_0_Ex Val_Zero[0] N001 AND1  ; pins Vdd Vss A B Out
XU2 Vdd 0 Sel_0_Ex Val_Zero[1] N006 AND1  ; pins Vdd Vss A B Out
XU3 Vdd 0 Sel_0_Ex Val_Zero[2] N011 AND1  ; pins Vdd Vss A B Out
XU4 Vdd 0 Sel_0_Ex Val_Zero[3] N016 AND1  ; pins Vdd Vss A B Out
XU5 Vdd 0 Sel_0_Ex Val_Zero[4] N021 AND1  ; pins Vdd Vss A B Out
XU6 Vdd 0 Sel_0_Ex Val_Zero[5] N026 AND1  ; pins Vdd Vss A B Out
XU7 Vdd 0 Sel_0_Ex Val_Zero[6] N031 AND1  ; pins Vdd Vss A B Out
XU8 Vdd 0 Sel_0_Ex Val_Zero[7] N036 AND1  ; pins Vdd Vss A B Out
XU9 Vdd 0 Sel_P1A_Ex Val_Plus_A[0] N002 AND1  ; pins Vdd Vss A B Out
XU10 Vdd 0 Sel_P1A_Ex Val_Plus_A[1] N007 AND1  ; pins Vdd Vss A B Out
XU11 Vdd 0 Sel_P1A_Ex Val_Plus_A[2] N012 AND1  ; pins Vdd Vss A B Out
XU12 Vdd 0 Sel_P1A_Ex Val_Plus_A[3] N017 AND1  ; pins Vdd Vss A B Out
XU13 Vdd 0 Sel_P1A_Ex Val_Plus_A[4] N022 AND1  ; pins Vdd Vss A B Out
XU14 Vdd 0 Sel_P1A_Ex Val_Plus_A[5] N027 AND1  ; pins Vdd Vss A B Out
XU15 Vdd 0 Sel_P1A_Ex Val_Plus_A[6] N032 AND1  ; pins Vdd Vss A B Out
XU16 Vdd 0 Sel_P1A_Ex Val_Plus_A[7] N037 AND1  ; pins Vdd Vss A B Out
XU17 Vdd 0 Sel_N1A_Ex Val_Minus_A[0] N003 AND1  ; pins Vdd Vss A B Out
XU18 Vdd 0 Sel_N1A_Ex Val_Minus_A[1] N008 AND1  ; pins Vdd Vss A B Out
XU19 Vdd 0 Sel_N1A_Ex Val_Minus_A[2] N013 AND1  ; pins Vdd Vss A B Out
XU20 Vdd 0 Sel_N1A_Ex Val_Minus_A[3] N018 AND1  ; pins Vdd Vss A B Out
XU21 Vdd 0 Sel_N1A_Ex Val_Minus_A[4] N023 AND1  ; pins Vdd Vss A B Out
XU22 Vdd 0 Sel_N1A_Ex Val_Minus_A[5] N028 AND1  ; pins Vdd Vss A B Out
XU23 Vdd 0 Sel_N1A_Ex Val_Minus_A[6] N033 AND1  ; pins Vdd Vss A B Out
XU24 Vdd 0 Sel_N1A_Ex Val_Minus_A[7] N038 AND1  ; pins Vdd Vss A B Out
XU25 Vdd 0 Sel_P2A_Ex Val_Plus_2A[0] N004 AND1  ; pins Vdd Vss A B Out
XU26 Vdd 0 Sel_P2A_Ex Val_Plus_2A[1] N009 AND1  ; pins Vdd Vss A B Out
XU27 Vdd 0 Sel_P2A_Ex Val_Plus_2A[2] N014 AND1  ; pins Vdd Vss A B Out
XU28 Vdd 0 Sel_P2A_Ex Val_Plus_2A[3] N019 AND1  ; pins Vdd Vss A B Out
XU29 Vdd 0 Sel_P2A_Ex Val_Plus_2A[4] N024 AND1  ; pins Vdd Vss A B Out
XU30 Vdd 0 Sel_P2A_Ex Val_Plus_2A[5] N029 AND1  ; pins Vdd Vss A B Out
XU31 Vdd 0 Sel_P2A_Ex Val_Plus_2A[6] N034 AND1  ; pins Vdd Vss A B Out
XU32 Vdd 0 Sel_P2A_Ex Val_Plus_2A[7] N039 AND1  ; pins Vdd Vss A B Out
XU33 Vdd 0 Sel_N2A_Ex Val_Minus_2A[0] N005 AND1  ; pins Vdd Vss A B Out
XU34 Vdd 0 Sel_N2A_Ex Val_Minus_2A[1] N010 AND1  ; pins Vdd Vss A B Out
XU35 Vdd 0 Sel_N2A_Ex Val_Minus_2A[2] N015 AND1  ; pins Vdd Vss A B Out
XU36 Vdd 0 Sel_N2A_Ex Val_Minus_2A[3] N020 AND1  ; pins Vdd Vss A B Out
XU37 Vdd 0 Sel_N2A_Ex Val_Minus_2A[4] N025 AND1  ; pins Vdd Vss A B Out
XU38 Vdd 0 Sel_N2A_Ex Val_Minus_2A[5] N030 AND1  ; pins Vdd Vss A B Out
XU39 Vdd 0 Sel_N2A_Ex Val_Minus_2A[6] N035 AND1  ; pins Vdd Vss A B Out
XU40 Vdd 0 Sel_N2A_Ex Val_Minus_2A[7] N040 AND1  ; pins Vdd Vss A B Out
XU41 Vdd 0 N041 N005 N004 OR1  ; pins Vdd Vss Out A B
XU42 Vdd 0 N042 N041 N003 OR1  ; pins Vdd Vss Out A B
XU43 Vdd 0 N043 N042 N002 OR1  ; pins Vdd Vss Out A B
XU44 Vdd 0 PPx[0] N043 N001 OR1  ; pins Vdd Vss Out A B
XU45 Vdd 0 N044 N010 N009 OR1  ; pins Vdd Vss Out A B
XU46 Vdd 0 N045 N044 N008 OR1  ; pins Vdd Vss Out A B
XU47 Vdd 0 N046 N045 N007 OR1  ; pins Vdd Vss Out A B
XU48 Vdd 0 PPx[1] N046 N006 OR1  ; pins Vdd Vss Out A B
XU49 Vdd 0 N047 N015 N014 OR1  ; pins Vdd Vss Out A B
XU50 Vdd 0 N048 N047 N013 OR1  ; pins Vdd Vss Out A B
XU51 Vdd 0 N049 N048 N012 OR1  ; pins Vdd Vss Out A B
XU52 Vdd 0 PPx[2] N049 N011 OR1  ; pins Vdd Vss Out A B
XU53 Vdd 0 N050 N020 N019 OR1  ; pins Vdd Vss Out A B
XU54 Vdd 0 N051 N050 N018 OR1  ; pins Vdd Vss Out A B
XU55 Vdd 0 N052 N051 N017 OR1  ; pins Vdd Vss Out A B
XU56 Vdd 0 PPx[3] N052 N016 OR1  ; pins Vdd Vss Out A B
XU57 Vdd 0 N053 N025 N024 OR1  ; pins Vdd Vss Out A B
XU58 Vdd 0 N054 N053 N023 OR1  ; pins Vdd Vss Out A B
XU59 Vdd 0 N055 N054 N022 OR1  ; pins Vdd Vss Out A B
XU60 Vdd 0 PPx[4] N055 N021 OR1  ; pins Vdd Vss Out A B
XU61 Vdd 0 N056 N030 N029 OR1  ; pins Vdd Vss Out A B
XU62 Vdd 0 N057 N056 N028 OR1  ; pins Vdd Vss Out A B
XU63 Vdd 0 N058 N057 N027 OR1  ; pins Vdd Vss Out A B
XU64 Vdd 0 PPx[5] N058 N026 OR1  ; pins Vdd Vss Out A B
XU65 Vdd 0 N059 N035 N034 OR1  ; pins Vdd Vss Out A B
XU66 Vdd 0 N060 N059 N033 OR1  ; pins Vdd Vss Out A B
XU67 Vdd 0 N061 N060 N032 OR1  ; pins Vdd Vss Out A B
XU68 Vdd 0 PPx[6] N061 N031 OR1  ; pins Vdd Vss Out A B
XU69 Vdd 0 N062 N040 N039 OR1  ; pins Vdd Vss Out A B
XU70 Vdd 0 N063 N062 N038 OR1  ; pins Vdd Vss Out A B
XU71 Vdd 0 N064 N063 N037 OR1  ; pins Vdd Vss Out A B
XU72 Vdd 0 PPx[7] N064 N036 OR1  ; pins Vdd Vss Out A B
V1 Vdd 0 1.8
.lib AND1.sub
.lib OR1.sub
.backanno
.end